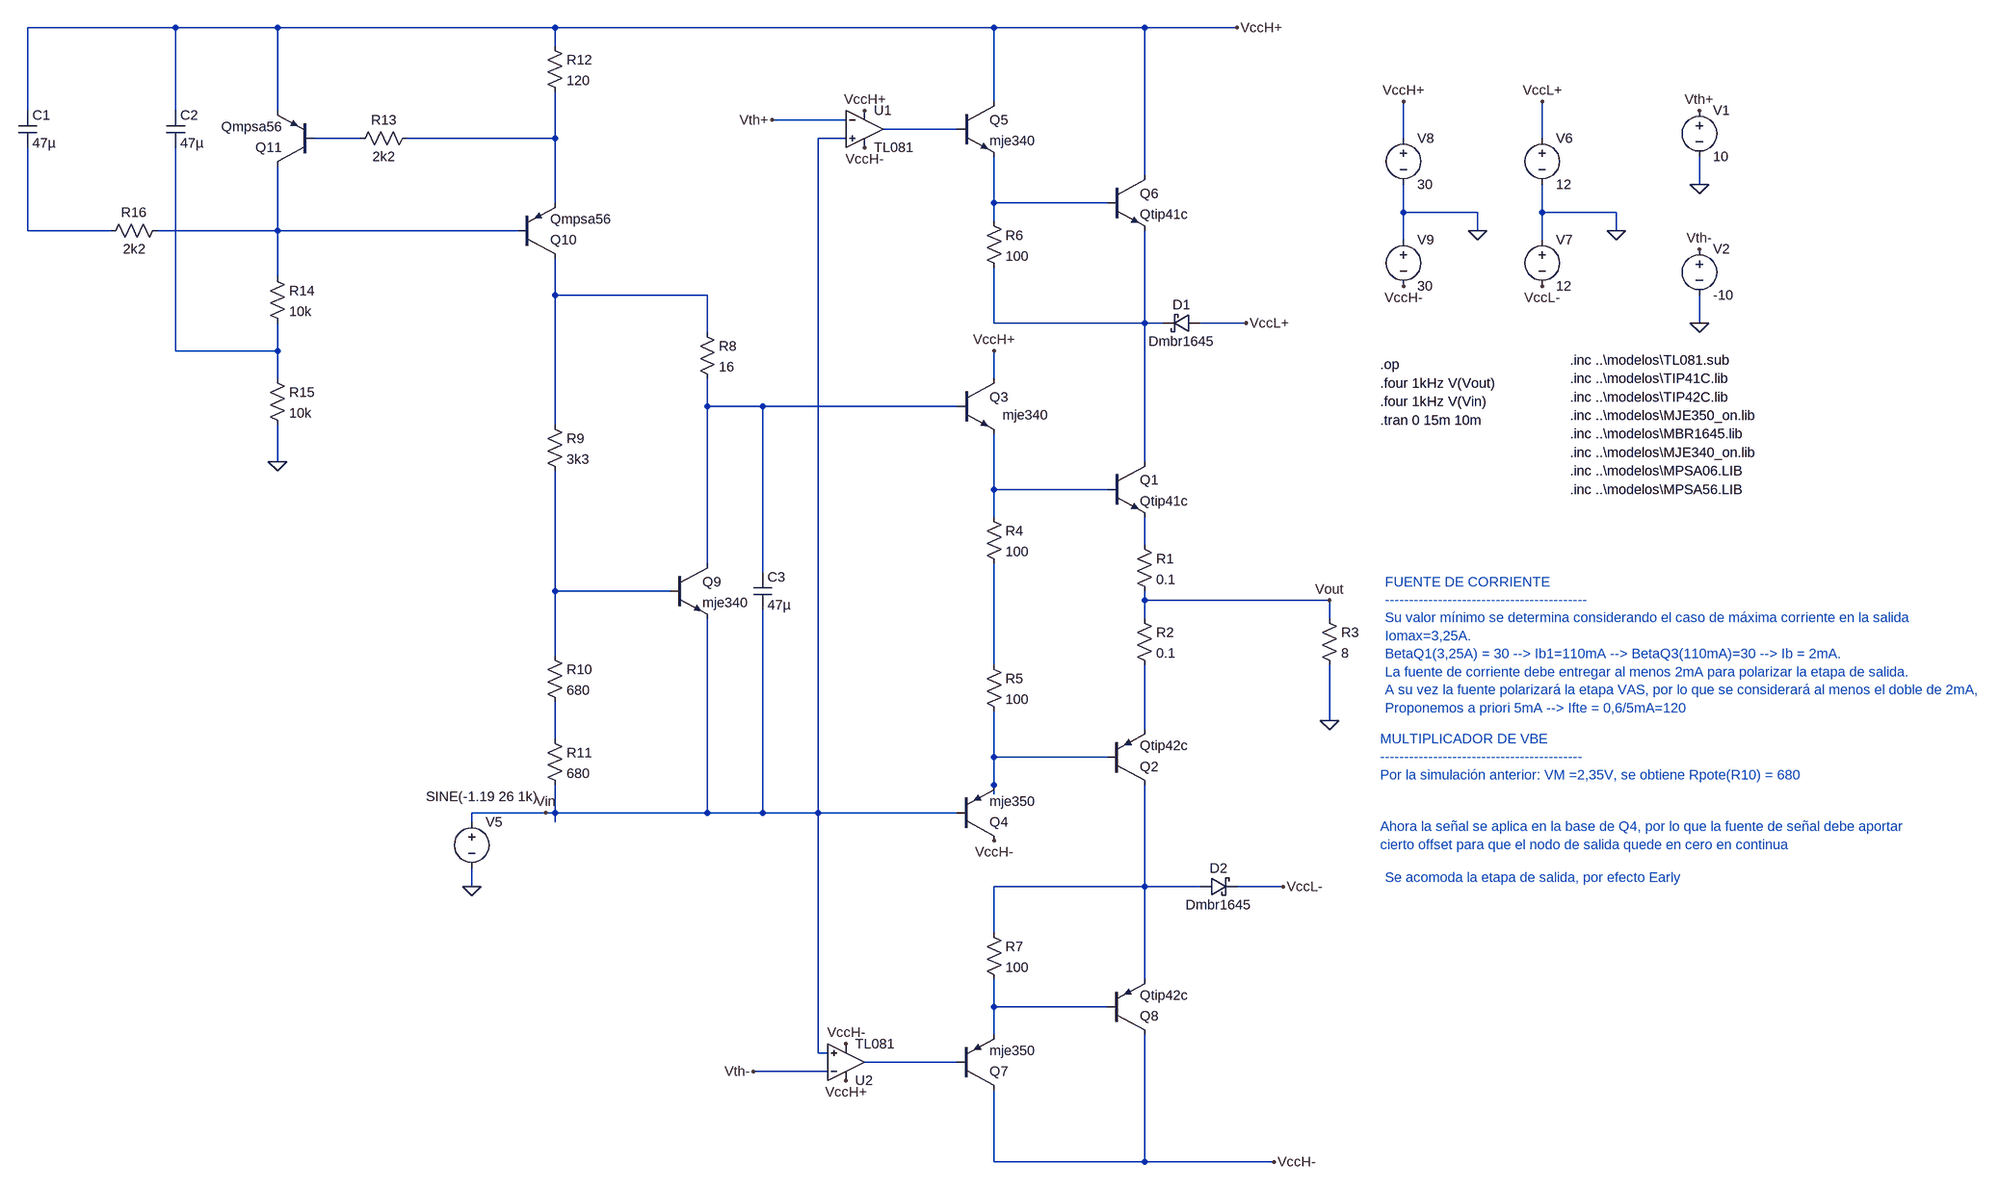
[diagram p0: schematic 1.1_salida.asc]
1.1_salida.asc, the LTspice schematic file:
Version 4
SHEET 1 1732 1428
WIRE -1456 -720 -1712 -720
WIRE -1280 -720 -1456 -720
WIRE -800 -720 -1280 -720
WIRE -32 -720 -800 -720
WIRE 240 -720 -32 -720
WIRE 400 -720 240 -720
WIRE -800 -688 -800 -720
WIRE -32 -592 -32 -720
WIRE -1712 -576 -1712 -720
WIRE -1456 -576 -1456 -720
WIRE -1280 -576 -1280 -720
WIRE -288 -560 -416 -560
WIRE -96 -544 -224 -544
WIRE -1136 -528 -1216 -528
WIRE -800 -528 -800 -608
WIRE -800 -528 -1056 -528
WIRE -288 -528 -336 -528
WIRE 688 -528 688 -592
WIRE 928 -528 928 -592
WIRE 240 -464 240 -720
WIRE 1200 -448 1200 -496
WIRE -800 -416 -800 -528
WIRE -32 -416 -32 -496
WIRE 176 -416 -32 -416
WIRE 688 -400 688 -448
WIRE 816 -400 688 -400
WIRE 928 -400 928 -448
WIRE 1056 -400 928 -400
WIRE -32 -384 -32 -416
WIRE -1712 -368 -1712 -512
WIRE -1568 -368 -1712 -368
WIRE -1280 -368 -1280 -480
WIRE -1280 -368 -1488 -368
WIRE -864 -368 -1280 -368
WIRE 816 -368 816 -400
WIRE 1056 -368 1056 -400
WIRE 688 -352 688 -400
WIRE 928 -352 928 -400
WIRE -1280 -288 -1280 -368
WIRE -800 -256 -800 -320
WIRE -528 -256 -800 -256
WIRE -32 -208 -32 -304
WIRE 240 -208 240 -368
WIRE 240 -208 -32 -208
WIRE 272 -208 240 -208
WIRE 416 -208 336 -208
WIRE 1200 -208 1200 -256
WIRE -528 -192 -528 -256
WIRE -1456 -160 -1456 -512
WIRE -1280 -160 -1280 -208
WIRE -1280 -160 -1456 -160
WIRE -1280 -112 -1280 -160
WIRE -32 -112 -32 -160
WIRE -528 -64 -528 -112
WIRE -432 -64 -528 -64
WIRE -96 -64 -432 -64
WIRE -800 -32 -800 -256
WIRE -1280 32 -1280 -32
WIRE 240 32 240 -208
WIRE -32 80 -32 -16
WIRE 176 80 -32 80
WIRE -32 128 -32 80
WIRE 240 176 240 128
WIRE -528 208 -528 -64
WIRE -432 224 -432 -64
WIRE -800 256 -800 48
WIRE -592 256 -800 256
WIRE 240 272 240 256
WIRE 560 272 240 272
WIRE 240 304 240 272
WIRE 560 304 560 272
WIRE -800 368 -800 256
WIRE -32 384 -32 208
WIRE 560 480 560 384
WIRE 240 496 240 384
WIRE -800 512 -800 448
WIRE -32 544 -32 464
WIRE 176 544 -32 544
WIRE -32 592 -32 544
WIRE -32 608 -32 592
WIRE -816 640 -944 640
WIRE -800 640 -800 592
WIRE -800 640 -816 640
WIRE -528 640 -528 304
WIRE -528 640 -800 640
WIRE -432 640 -432 288
WIRE -432 640 -528 640
WIRE -336 640 -336 -528
WIRE -336 640 -432 640
WIRE -96 640 -336 640
WIRE -944 656 -944 640
WIRE -800 656 -800 640
WIRE -944 768 -944 736
WIRE 240 768 240 592
WIRE 240 768 -32 768
WIRE 336 768 240 768
WIRE 480 768 400 768
WIRE -32 848 -32 768
WIRE 240 928 240 768
WIRE -32 976 -32 928
WIRE 176 976 -32 976
WIRE -32 1024 -32 976
WIRE -336 1056 -336 640
WIRE -320 1056 -336 1056
WIRE -96 1072 -256 1072
WIRE -320 1088 -448 1088
WIRE -32 1248 -32 1120
WIRE 240 1248 240 1024
WIRE 240 1248 -32 1248
WIRE 464 1248 240 1248
FLAG 560 480 0
FLAG -944 768 0
FLAG 560 272 Vout
FLAG -816 640 Vin
FLAG 816 -368 0
FLAG 688 -592 VccH+
FLAG 688 -272 VccH-
FLAG 400 -720 VccH+
FLAG 464 1248 VccH-
FLAG 1056 -368 0
FLAG 928 -592 VccL+
FLAG 928 -272 VccL-
FLAG 416 -208 VccL+
FLAG 480 768 VccL-
FLAG -256 -576 VccH+
FLAG -256 -512 VccH-
FLAG -416 -560 Vth+
FLAG -288 1104 VccH+
FLAG -288 1040 VccH-
FLAG -448 1088 Vth-
FLAG 1200 -448 0
FLAG 1200 -576 Vth+
FLAG 1200 -208 0
FLAG 1200 -336 Vth-
FLAG -1280 32 0
FLAG -32 -160 VccH+
FLAG -32 688 VccH-
DATAFLAG 96 80 ""
DATAFLAG 240 160 "I(R1)"
DATAFLAG -528 -64 ""
DATAFLAG -608 640 ""
DATAFLAG 240 432 "I(R2)"
DATAFLAG 368 272 ""
DATAFLAG 64 544 ""
DATAFLAG 144 768 ""
DATAFLAG 64 976 ""
DATAFLAG 128 -208 ""
DATAFLAG -32 -624 "Ic(Q5)"
DATAFLAG -32 0 "Ic(Q3)"
DATAFLAG -32 592 "Ic(Q4)"
DATAFLAG -800 -256 "Ic(Q10)"
DATAFLAG -800 -576 "I(R12)"
SYMBOL npn 176 32 R0
SYMATTR InstName Q1
SYMATTR Value Qtip41c
SYMBOL npn -96 -112 R0
WINDOW 3 79 63 Left 2
SYMATTR Value mje340
SYMATTR InstName Q3
SYMBOL pnp 176 592 M180
SYMATTR InstName Q2
SYMATTR Value Qtip42c
SYMBOL res 224 160 R0
SYMATTR InstName R1
SYMATTR Value 0.1
SYMBOL res 224 288 R0
SYMATTR InstName R2
SYMATTR Value 0.1
SYMBOL res 544 288 R0
SYMATTR InstName R3
SYMATTR Value 8
SYMBOL pnp -96 688 M180
SYMATTR InstName Q4
SYMATTR Value mje350
SYMBOL res -48 112 R0
SYMATTR InstName R4
SYMATTR Value 100
SYMBOL res -48 368 R0
SYMATTR InstName R5
SYMATTR Value 100
SYMBOL voltage -944 640 R0
WINDOW 3 -79 -28 Left 2
WINDOW 123 0 0 Left 2
WINDOW 39 0 0 Left 2
SYMATTR Value SINE(-1.19 26 1k)
SYMATTR InstName V5
SYMBOL res -48 -400 R0
SYMATTR InstName R6
SYMATTR Value 100
SYMBOL npn -96 -592 R0
SYMATTR InstName Q5
SYMATTR Value mje340
SYMBOL npn 176 -464 R0
SYMATTR InstName Q6
SYMATTR Value Qtip41c
SYMBOL schottky 336 -224 R90
WINDOW 0 0 32 VBottom 2
WINDOW 3 32 32 VTop 2
SYMATTR InstName D1
SYMATTR Value Dmbr1645
SYMBOL schottky 336 784 R270
WINDOW 0 32 32 VTop 2
WINDOW 3 0 32 VBottom 2
SYMATTR InstName D2
SYMATTR Value Dmbr1645
SYMBOL pnp 176 1024 M180
SYMATTR InstName Q8
SYMATTR Value Qtip42c
SYMBOL pnp -96 1120 M180
SYMATTR InstName Q7
SYMATTR Value mje350
SYMBOL res -48 832 R0
SYMATTR InstName R7
SYMATTR Value 100
SYMBOL Opamps\\opamp2 -256 -608 R0
SYMATTR InstName U1
SYMATTR Value TL081
SYMBOL voltage 688 -544 R0
WINDOW 123 0 0 Left 2
WINDOW 39 0 0 Left 2
SYMATTR InstName V8
SYMATTR Value 30
SYMBOL voltage 688 -368 R0
WINDOW 123 0 0 Left 2
WINDOW 39 0 0 Left 2
SYMATTR InstName V9
SYMATTR Value 30
SYMBOL voltage 928 -544 R0
WINDOW 123 0 0 Left 2
WINDOW 39 0 0 Left 2
SYMATTR InstName V6
SYMATTR Value 12
SYMBOL voltage 928 -368 R0
WINDOW 123 0 0 Left 2
WINDOW 39 0 0 Left 2
SYMATTR InstName V7
SYMATTR Value 12
SYMBOL Opamps\\opamp2 -288 1136 M180
SYMATTR InstName U2
SYMATTR Value TL081
SYMBOL voltage 1200 -592 R0
WINDOW 123 0 0 Left 2
WINDOW 39 0 0 Left 2
SYMATTR InstName V1
SYMATTR Value 10
SYMBOL voltage 1200 -352 R0
WINDOW 123 0 0 Left 2
WINDOW 39 0 0 Left 2
SYMATTR InstName V2
SYMATTR Value -10
SYMBOL npn -592 208 R0
SYMATTR InstName Q9
SYMATTR Value mje340
SYMBOL res -544 -208 R0
SYMATTR InstName R8
SYMATTR Value 16
SYMBOL res -816 -48 R0
SYMATTR InstName R9
SYMATTR Value 3k3
SYMBOL res -816 352 R0
SYMATTR InstName R10
SYMATTR Value 680
SYMBOL res -816 496 R0
SYMATTR InstName R11
SYMATTR Value 680
SYMBOL pnp -864 -320 M180
SYMATTR InstName Q10
SYMATTR Value Qmpsa56
SYMBOL res -816 -704 R0
SYMATTR InstName R12
SYMATTR Value 120
SYMBOL res -1040 -544 R90
WINDOW 0 0 56 VBottom 2
WINDOW 3 32 56 VTop 2
SYMATTR InstName R13
SYMATTR Value 2k2
SYMBOL pnp -1216 -480 R180
SYMATTR InstName Q11
SYMATTR Value Qmpsa56
SYMBOL res -1296 -304 R0
SYMATTR InstName R14
SYMATTR Value 10k
SYMBOL res -1296 -128 R0
SYMATTR InstName R15
SYMATTR Value 10k
SYMBOL res -1472 -384 R90
WINDOW 0 0 56 VBottom 2
WINDOW 3 32 56 VTop 2
SYMATTR InstName R16
SYMATTR Value 2k2
SYMBOL cap -1728 -576 R0
SYMATTR InstName C1
SYMATTR Value 47µ
SYMBOL cap -1472 -576 R0
SYMATTR InstName C2
SYMATTR Value 47µ
SYMBOL cap -448 224 R0
SYMATTR InstName C3
SYMATTR Value 47µ
TEXT 648 -40 Left 2 !.tran 0 15m 10m
TEXT 648 -72 Left 2 !.four 1kHz V(Vin)
TEXT 648 -104 Left 2 !.four 1kHz V(Vout)
TEXT 648 -136 Left 2 !.op
TEXT 976 48 Left 2 !.inc ..\\modelos\\MPSA06.LIB
TEXT 976 80 Left 2 !.inc ..\\modelos\\MPSA56.LIB
TEXT 656 240 Left 2 ;FUENTE DE CORRIENTE\n------------------------------------------\nSu valor mínimo se determina considerando el caso de máxima corriente en la salida\nIomax=3,25A. \nBetaQ1(3,25A) = 30 --> Ib1=110mA --> BetaQ3(110mA)=30 --> Ib = 2mA.\nLa fuente de corriente debe entregar al menos 2mA para polarizar la etapa de salida.\nA su vez la fuente polarizará la etapa VAS, por lo que se considerará al menos el doble de 2mA,\nProponemos a priori 5mA --> Ifte = 0,6/5mA=120
TEXT 648 512 Left 2 ;MULTIPLICADOR DE VBE\n------------------------------------------\nPor la simulación anterior: VM =2,35V, se obtiene Rpote(R10) = 680
TEXT 648 664 Left 2 ;Ahora la señal se aplica en la base de Q4, por lo que la fuente de señal debe aportar \ncierto offset para que el nodo de salida quede en cero en continua
TEXT 656 752 Left 2 ;Se acomoda la etapa de salida, por efecto Early
TEXT 976 -144 Left 2 !.inc ..\\modelos\\TL081.sub
TEXT 976 -112 Left 2 !.inc ..\\modelos\\TIP41C.lib
TEXT 976 -80 Left 2 !.inc ..\\modelos\\TIP42C.lib
TEXT 976 16 Left 2 !.inc ..\\modelos\\MJE340_on.lib
TEXT 976 -48 Left 2 !.inc ..\\modelos\\MJE350_on.lib
TEXT 976 -16 Left 2 !.inc ..\\modelos\\MBR1645.lib

The netlist it stands for:
* 1.1_salida.asc
Q1 N008 N011 N012 0 Qtip41c
Q3 VccH+ N010 N011 0 mje340
Q2 N018 N017 N015 0 Qtip42c
R1 N012 Vout 0.1
R2 Vout N015 0.1
R3 Vout 0 8
Q4 VccH- Vin N017 0 mje350
R4 N011 N014 100
R5 N014 N017 100
V5 Vin 0 SINE(-1.19 26 1k)
R6 N004 N008 100
Q5 VccH+ N001 N004 0 mje340
Q6 VccH+ N004 N008 0 Qtip41c
D1 VccL+ N008 Dmbr1645
D2 N018 VccL- Dmbr1645
Q8 VccH- N019 N018 0 Qtip42c
Q7 VccH- N020 N019 0 mje350
R7 N018 N019 100
XU1 Vin Vth+ VccH+ VccH- N001 TL081  ; pins In+ In- V+ V- OUT
V8 VccH+ 0 30
V9 0 VccH- 30
V6 VccL+ 0 12
V7 0 VccL- 12
XU2 Vin Vth- VccH+ VccH- N020 TL081  ; pins In+ In- V+ V- OUT
V1 Vth+ 0 10
V2 Vth- 0 -10
Q9 N010 N013 Vin 0 mje340
R8 N007 N010 16
R9 N007 N013 3k3
R10 N013 N016 680
R11 N016 Vin 680
Q10 N007 N006 N003 0 Qmpsa56
R12 VccH+ N003 120
R13 N003 N002 2k2
Q11 N006 N002 VccH+ 0 Qmpsa56
R14 N006 N009 10k
R15 N009 0 10k
R16 N006 N005 2k2
C1 VccH+ N005 47µ
C2 VccH+ N009 47µ
C3 N010 Vin 47µ
.model D D
.lib standard.dio
.model NPN NPN
.model PNP PNP
.lib standard.bjt
.tran 0 15m 10m
.four 1kHz V(Vin)
.four 1kHz V(Vout)
.op
.inc ..\modelos\MPSA06.LIB
.inc ..\modelos\MPSA56.LIB
* FUENTE DE CORRIENTE
* ------------------------------------------
* Su valor mínimo se determina considerando el caso de máxima corriente en la salida
* Iomax=3,25A.
* BetaQ1(3,25A) = 30 --> Ib1=110mA --> BetaQ3(110mA)=30 --> Ib = 2mA.
* La fuente de corriente debe entregar al menos 2mA para polarizar la etapa de salida.
* A su vez la fuente polarizará la etapa VAS, por lo que se considerará al menos el doble de 2mA,
* Proponemos a priori 5mA --> Ifte = 0,6/5mA=120
* MULTIPLICADOR DE VBE
* ------------------------------------------
* Por la simulación anterior: VM =2,35V, se obtiene Rpote(R10) = 680
* Ahora la señal se aplica en la base de Q4, por lo que la fuente de señal debe aportar
* cierto offset para que el nodo de salida quede en cero en continua
* Se acomoda la etapa de salida, por efecto Early
.inc ..\modelos\TL081.sub
.inc ..\modelos\TIP41C.lib
.inc ..\modelos\TIP42C.lib
.inc ..\modelos\MJE340_on.lib
.inc ..\modelos\MJE350_on.lib
.inc ..\modelos\MBR1645.lib
.backanno
.end